# Altium schematic sheet ESP32-Download-Motherboard.SchDoc
size A4; DocumentNumber: 1; SheetNumber: 1; SheetTotal: 1
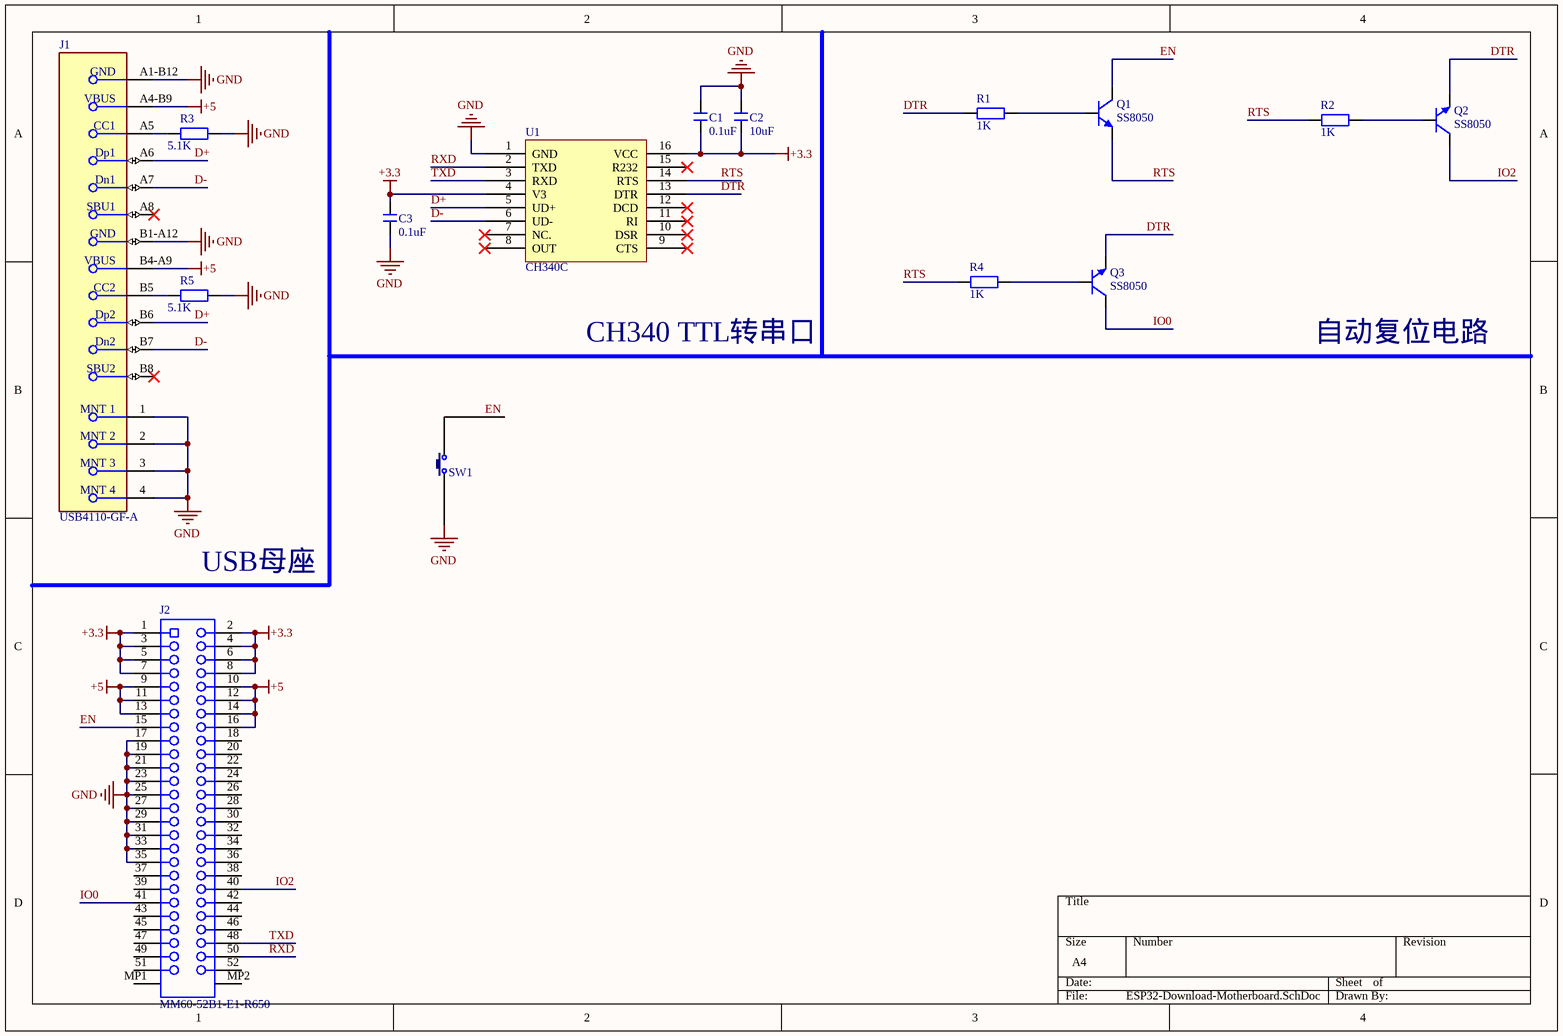
[diagram p0: ESP32-Download-Motherboard.SchDoc]

## Parts
C1  0.1uF  [C 0603_L]
C2  10uF  [C 0603_L]
C3  0.1uF  [C 0603_L]
J1  USB4110-GF-A  [FP-USB4110-GF-A-MFG]
J2  MM60-52B1-E1-R650  [MINI_PCIE_CONN_3130]
Q1  SS8050  [SOT23-3N]
Q2  SS8050  [SOT23-3N]
Q3  SS8050  [SOT23-3N]
R1  1K  [R 0603_L]
R2  1K  [R 0603_L]
R3  5.1K  [R 0603_L]
R4  1K  [R 0603_L]
R5  5.1K  [R 0603_L]
SW1  3x6x5  [TSW SMD-3*6*2.5]  (value not drawn)
U1  CH340C  [SOP16N_N]

## Nets
+3.3: C1.1 C2.1 C3.2 J2.1 J2.2 J2.3 J2.4 J2.5 J2.6 J2.7 J2.8 U1.4(V3) U1.16(VCC)
+5: J1.A4-B9(VBUS) J1.B4-A9(VBUS) J2.9 J2.10 J2.11 J2.12 J2.13 J2.14 J2.16
GND: C1.2 C2.2 C3.1 J1.1(MNT_1) J1.2(MNT_2) J1.3(MNT_3) J1.4(MNT_4) J1.A1-B12(GND) J1.B1-A12(GND) J2.17 J2.19 J2.21 J2.23 J2.25 J2.27 J2.29 J2.31 J2.33 J2.35 R3.2 R5.2 SW1.1 U1.1(GND)
D+: J1.A6(Dp1) J1.B6(Dp2) U1.5(UD+)
D-: J1.A7(Dn1) J1.B7(Dn2) U1.6(UD-)
DTR: Q2.2(E) Q3.2(E) R1.1 U1.13(DTR)
EN: J2.15 Q1.3(C) SW1.2
IO0: J2.41 Q3.3(C)
IO2: J2.40 Q2.3(C)
RTS: Q1.2(E) R2.1 R4.1 U1.14(RTS)
RXD: J2.50 U1.2(TXD)
TXD: J2.48 U1.3(RXD)
NetJ1_A5: J1.A5(CC1) R3.1
NetJ1_B5: J1.B5(CC2) R5.1
NetQ1_1: Q1.1(B) R1.2
NetQ2_1: Q2.1(B) R2.2
NetQ3_1: Q3.1(B) R4.2

Not connected (* = marked no-connect by the designer): J1 A8(SBU1)* B8(SBU2)*; J2 18 20 22 24 26 28 30 32 34 36 37 38 39 42 43 44 45 46 47 49 51 52 MP1 MP2; U1 7(NC.)* 8(OUT)* 9(CTS)* 10(DSR)* 11(RI)* 12(DCD)* 15(R232)*

## Notes on the sheet
- CH340 TTL转串口
- 自动复位电路
- USB母座

## Library data of the parts
C1-C3 = C: 无极性贴片电容; 材质: X7R; BOM名称: 无极性贴片电容
J1 = CMP-245163-000002-1: CONN USB 2.0 TYPE-C R/A SMT; Manufacturer: GCT; Conn Orientation: Right Angle; Usb Standard: USB 2.0; Voltage Rating: 20V; Current Rating: 3/4.25/1.25/0.25A; Number Of Contacts: 16; Is Female: yes; Shielding: true; Standoff Height: 0.1mm; Octopart: https://octopart.com/usb4110-gf-a-gct-103941985; Temperature: -40°C to +85°C; RoHS: TRUE; Automotive: No; Contact Material: Gold,Nickel; Device Class L1: Connectors; Device Class L2: USB Connectors; Package: 0; Lead Free: Yes; ComponentLink2URL: https://gct.co/files/drawings/usb4110.pdf; Temperature Range High: +85°C; Temperature Range Low: -40°C; Height: 3.46mm; Manufacturer Part Number: USB4110-GF-A; ComponentLink2Description: Datasheet; Device Class L3: unset; Digikey Description: CONN USB 2.0 TYPE-C R/A SMT; Category: Conn
J2 = MINI_PCIE_CONN: Compatible with PCI Express Mini Card, 5.9 mm Height, -40 to 85 degC, 52-Pin SMD, RoHS, Tape and Reel; Manufacturer: JAE Electronics; Product Training Modules: MM60PCIeMiniCardConnectorMemoryModules,theSM3andMM60SeriesofConnectors; Pitch: 0.031"(0.80mm); Associated Product: 670-2277-2-ND-CONNMINIEXPRESSCARDLATCHSMD670-2277-1-ND-CONNMINIEXPRESSCARDLATCHSMD670-2277-6-ND-CONNMINIEXPRESSCARDLATCHSMD; Read Out: Dual; Other Names: 670-2275-6; Number of Positions: 52; Online Catalog: MM60Series; Other Related Documents: CardSelectionGuide; Package Version: Rev. 2, 01/2006; Material - Insulation: Thermoplastic; Catalog Drawings: MM60SeriesSideMM60SeriesTop; Gender: Female; Featured Product: MM60PCIeMiniCardConnector; Card Thickness: 0.039"(1.00mm); Number of Positions/Bay/Row: -; Category: Connectors,Interconnects; Termination: Solder; Series: MM60; Card Type: PCIExpressMiniCard; Flange Feature: -; Contact Type: -; Family: CardEdgeConnectors-EdgeboardConnectors; Package Reference: MM60-52B1; Manufacturer URL: http://www.jaeusa.com/; Contact Material: CopperAlloy; Mounting Technology: SurfaceMount; Operating Temperature: -40°C~85°C; Package URL: https://datasheet.ciiva.com/7633/332207-7633323.pdf; Contact Finish Thickness: 3.9µin(0.10µm); Datasheet Version: 04/2015; Datasheet URL: http://www.jae.com/z-en/pdf_download_exec.cfm?param=MB-0147-6E_MM60.pdf; Contact Finish: Gold; Standard Package: 1; Mounting Type: SurfaceMount,RightAngle; Packaging: Digi-Reel®; Number of Rows: 2; Color: -; Package Description: 52-Pin Surface Mount Device, Body 28.4 x 10 mm, Pitch 0.8 mm; Features: BoardGuide; Manufacturer Part Number: MM60-52B1-E1-R650
Q1-Q3 = 8050-SMD: 高频放大-NPN型; 属性: 40V 1.5A 1W 100MHZ; BOM名称: 高频放大-NPN型
R1-R5 = R: 贴片电阻; BOM名称: 贴片电阻
SW1 = TSW 3x6: 3x6轻触开关; BOM名称: 3x6轻触开关